# Altium schematic sheet [06]EXT_UART.SchDoc
size B
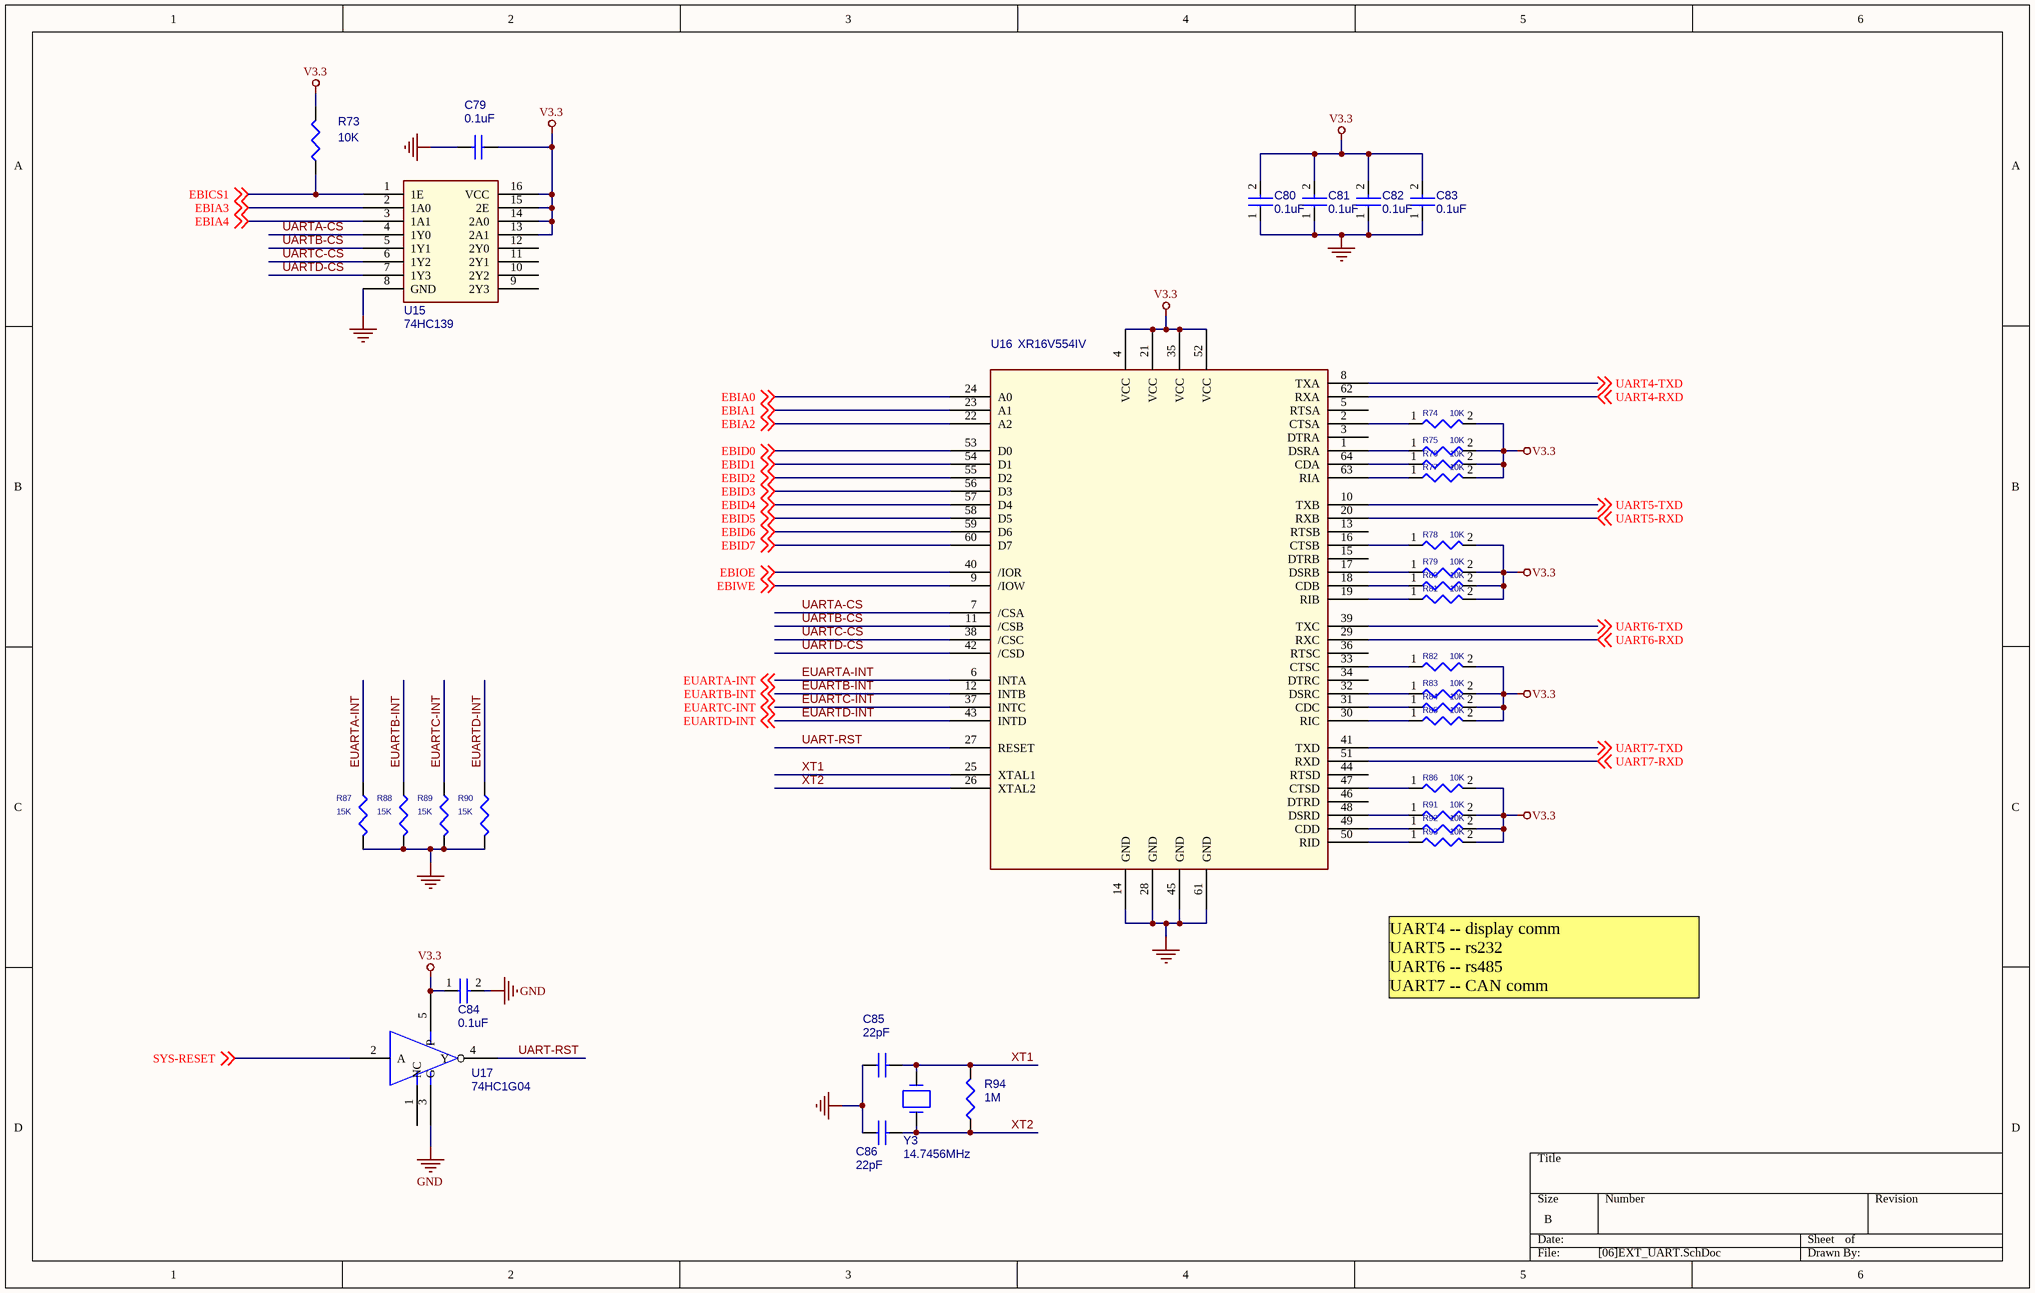
[diagram p0: [06]EXT_UART.SchDoc]

## Parts
C79  0.1uF  [0603]
C80  0.1uF  [0603]
C81  0.1uF  [0603]
C82  0.1uF  [0603]
C83  0.1uF  [0603]
C84  0.1uF  [0603]
C85  22pF  [0603]
C86  22pF  [0603]
R73  10K  [0603]
R74  10K  [0603]
R75  10K  [0603]
R76  10K  [0603]
R77  10K  [0603]
R78  10K  [0603]
R79  10K  [0603]
R80  10K  [0603]
R81  10K  [0603]
R82  10K  [0603]
R83  10K  [0603]
R84  10K  [0603]
R85  10K  [0603]
R86  10K  [0603]
R87  15K  [0603]
R88  15K  [0603]
R89  15K  [0603]
R90  15K  [0603]
R91  10K  [0603]
R92  10K  [0603]
R93  10K  [0603]
R94  1M  [0603]
U15  74HC139  [SO-16]
U16  XR16V554IV  [LQFP64]
U17  74HC1G04  [SOT753]
Y3  14.7456MHz  [XTAL_SMD]

## Nets
GND: C79.2 C80.1 C81.1 C82.1 C83.1 C84.2 C85.1 C86.1 R87.2 R88.2 R89.2 R90.2 U15.8(GND) U16.14(GND) U16.28(GND) U16.45(GND) U16.61(GND) U17.3(G)
V3.3: C79.1 C80.2 C81.2 C82.2 C83.2 C84.1 R73.2 R74.2 R75.2 R76.2 R77.2 R78.2 R79.2 R80.2 R81.2 R82.2 R83.2 R84.2 R85.2 R86.2 R91.2 R92.2 R93.2 U15.13(2A1) U15.14(2A0) U15.15(2E) U15.16(VCC) U16.4(VCC) U16.21(VCC) U16.35(VCC) U16.52(VCC) U17.5(P)
EBIA0: U16.24(A0) ; off-sheet EBIA0
EBIA1: U16.23(A1) ; off-sheet EBIA1
EBIA2: U16.22(A2) ; off-sheet EBIA2
EBIA3: U15.2(1A0) ; off-sheet EBIA3
EBIA4: U15.3(1A1) ; off-sheet EBIA4
EBICS1: R73.1 U15.1(1E) ; off-sheet EBICS1
EBID0: U16.53(D0) ; off-sheet EBID0
EBID1: U16.54(D1) ; off-sheet EBID1
EBID2: U16.55(D2) ; off-sheet EBID2
EBID3: U16.56(D3) ; off-sheet EBID3
EBID4: U16.57(D4) ; off-sheet EBID4
EBID5: U16.58(D5) ; off-sheet EBID5
EBID6: U16.59(D6) ; off-sheet EBID6
EBID7: U16.60(D7) ; off-sheet EBID7
EBIOE: U16.40(/IOR) ; off-sheet EBIOE
EBIWE: U16.9(/IOW) ; off-sheet EBIWE
EUARTA-INT: R87.1 U16.6(INTA) ; off-sheet EUARTA-INT
EUARTB-INT: R88.1 U16.12(INTB) ; off-sheet EUARTB-INT
EUARTC-INT: R89.1 U16.37(INTC) ; off-sheet EUARTC-INT
EUARTD-INT: R90.1 U16.43(INTD) ; off-sheet EUARTD-INT
SYS-RESET: U17.2(A) ; off-sheet SYS-RESET
UART4-RXD: U16.62(RXA) ; off-sheet UART4-RXD
UART4-TXD: U16.8(TXA) ; off-sheet UART4-TXD
UART5-RXD: U16.20(RXB) ; off-sheet UART5-RXD
UART5-TXD: U16.10(TXB) ; off-sheet UART5-TXD
UART6-RXD: U16.29(RXC) ; off-sheet UART6-RXD
UART6-TXD: U16.39(TXC) ; off-sheet UART6-TXD
UART7-RXD: U16.51(RXD) ; off-sheet UART7-RXD
UART7-TXD: U16.41(TXD) ; off-sheet UART7-TXD
UART-RST: U16.27(RESET) U17.4(Y)
UARTA-CS: U15.4(1Y0) U16.7(/CSA)
UARTB-CS: U15.5(1Y1) U16.11(/CSB)
UARTC-CS: U15.6(1Y2) U16.38(/CSC)
UARTD-CS: U15.7(1Y3) U16.42(/CSD)
XT1: C85.2 R94.2 U16.25(XTAL1) Y3.2
XT2: C86.2 R94.1 U16.26(XTAL2) Y3.1
NetR74_1: R74.1 U16.2(CTSA)
NetR75_1: R75.1 U16.1(DSRA)
NetR76_1: R76.1 U16.64(CDA)
NetR77_1: R77.1 U16.63(RIA)
NetR78_1: R78.1 U16.16(CTSB)
NetR79_1: R79.1 U16.17(DSRB)
NetR80_1: R80.1 U16.18(CDB)
NetR81_1: R81.1 U16.19(RIB)
NetR82_1: R82.1 U16.33(CTSC)
NetR83_1: R83.1 U16.32(DSRC)
NetR84_1: R84.1 U16.31(CDC)
NetR85_1: R85.1 U16.30(RIC)
NetR86_1: R86.1 U16.47(CTSD)
NetR91_1: R91.1 U16.48(DSRD)
NetR92_1: R92.1 U16.49(CDD)
NetR93_1: R93.1 U16.50(RID)

Not connected (* = marked no-connect by the designer): U15 9(2Y3) 10(2Y2) 11(2Y1) 12(2Y0); U16 3(DTRA) 5(RTSA) 13(RTSB) 15(DTRB) 34(DTRC) 36(RTSC) 44(RTSD) 46(DTRD); U17 1(NC)

## Notes on the sheet
- UART4 -- display comm
  UART5 -- rs232
  UART6 -- rs485
  UART7 -- CAN comm

## Library data of the parts
C79-C84 = CAP NP_Dup2
C85 C86 = CAP_Dup1
R73-R93 = R_Dup1
R94 = RESISTOR
U16 = XR16V554IV_4
U17 = 74LVC1G04GW_SOT353-5: Part  Number: SA00000FX00
Y3 = CRYSTAL